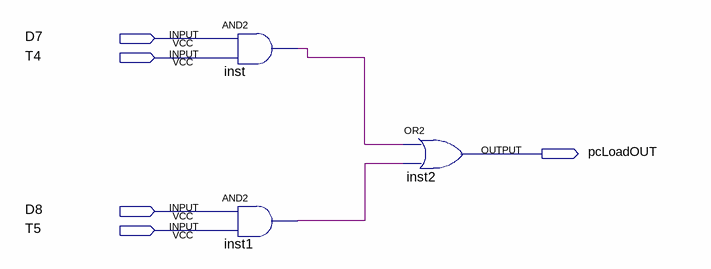
[diagram p0: schematic sheet]
// Quartus schematic pcLoad.bdf as structural Verilog: 3 symbols, 5 pins
module pcLoad (
  input  D7,
  input  T4,
  input  D8,
  input  T5,
  output pcLoadOUT
);

  wire inst1_out, inst_out;

  and inst (inst_out, D7, T4);
  and inst1 (inst1_out, D8, T5);
  or inst2 (pcLoadOUT, inst_out, inst1_out);
endmodule
